# EAGLE design sensor_elec_sd (EAGLE 6.5.0)
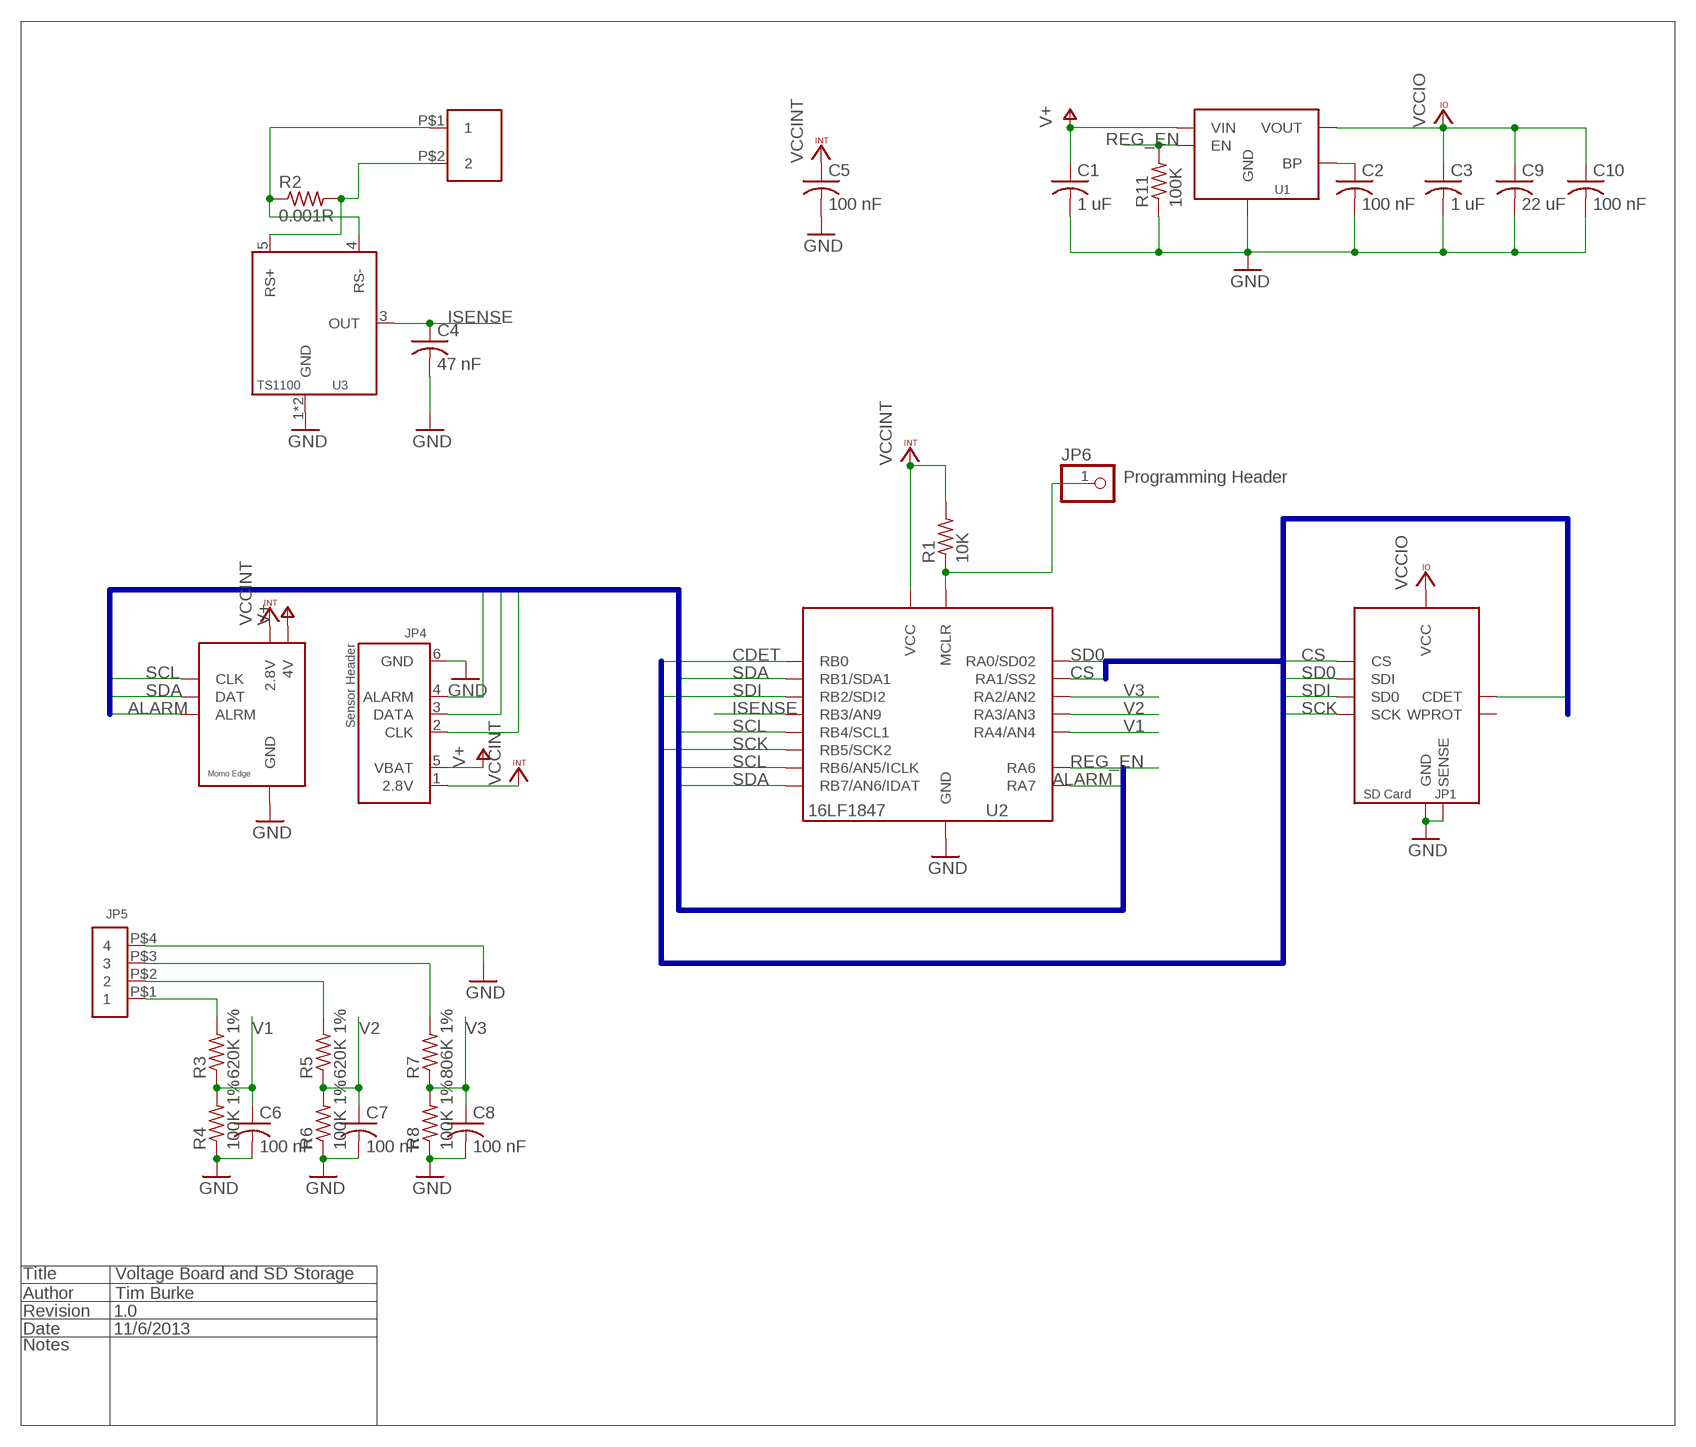
[diagram p0: schematic, sheet 1]

## Parts
C1  1 uF  C-USC0402K  [C0402K]
C2  100 nF  C-USC0402K  [C0402K]
C3  1 uF  C-USC0402K  [C0402K]
C4  47 nF  C-USC0402K  [C0402K]
C5  100 nF  C-USC0402K  [C0402K]
C6  100 nF  C-USC0402K  [C0402K]
C7  100 nF  C-USC0402K  [C0402K]
C8  100 nF  C-USC0402K  [C0402K]
C9  22 uF  C-USC1206K  [C1206K]
C10  100 nF  C-USC0402K  [C0402K]
JP1  SDCARD-HOLDER  [SDHOLDER-9PIN]
JP2  MOMO-VERT-6M  [1X06]
JP3  5MM-SCREWTERM-2POS  [5MM-SCREWTERM]
JP4  MOMO-SENSOR-RJ11  [RJ-12]
JP5  SCREWTERM4  [SCREWTERM4]
JP6  PINHD-1X1  [1X01]
R1  10K  R-US_R0603  [R0603]
R2  0.001R  R-US_R2512  [R2512]
R3  620K 1%  R-US_R0603  [R0603]
R4  100K 1%  R-US_R0603  [R0603]
R5  620K 1%  R-US_R0603  [R0603]
R6  100K 1%  R-US_R0603  [R0603]
R7  806K 1%  R-US_R0603  [R0603]
R8  100K 1%  R-US_R0603  [R0603]
R11  100K  R-US_R0603  [R0603]
U1  AP7115-LDO  [SOT353]
U2  16LF1847  [SSOP20]
U3  TS1100  [SOT23-5L]

## Nets
ALARM: JP2.5(ALRM) JP4.4(ALARM) U2.18(RA7)
CDET: JP1.CDETECT(CDET) U2.7(RB0)
CS: JP1.1(CS) U2.20(RA1/SS2)
GND: C1.2 C2.2 C3.2 C4.2 C5.2 C6.2 C7.2 C8.2 C9.2 C10.2 JP1.3(GND) JP1.6(GND) JP1.CDGND(SENSE) JP1.CDGND_BOT(SENSE) JP1.WPGND(SENSE) JP1.WPGND_BOT(SENSE) JP2.7(GND) JP4.6(GND) JP5.P$4 R4.1 R6.1 R8.1 R11.1 U1.2(GND) U2.5(GND) U2.6(GND) U3.1(GND) U3.2(GND)
ISENSE: C4.1 U2.10(RB3/AN9) U3.3(OUT)
N$3: C2.1 U1.4(BP)
N$4: JP6.1 R1.1 U2.4(MCLR)
N$10: JP5.P$1 R3.2
N$11: JP5.P$2 R5.2
N$12: JP5.P$3 R7.2
REG_EN: R11.2 U1.3(EN) U2.17(RA6)
RS+: JP3.P$2 R2.2 U3.5(RS+)
RS-: JP3.P$1 R2.1 U3.4(RS-)
SCK: JP1.5(SCK) U2.12(RB5/SCK2)
SCL: JP2.3(CLK) JP4.2(CLK) U2.11(RB4/SCL1) U2.13(RB6/AN5/ICLK)
SD0: JP1.2(SDI) U2.19(RA0/SD02)
SDA: JP2.4(DAT) JP4.3(DATA) U2.8(RB1/SDA1) U2.14(RB7/AN6/IDAT)
SDI: JP1.7(SD0) U2.9(RB2/SDI2)
V1: C6.1 R3.1 R4.2 U2.3(RA4/AN4)
V2: C7.1 R5.1 R6.2 U2.2(RA3/AN3)
V3: C8.1 R7.1 R8.2 U2.1(RA2/AN2)
V+: C1.1 JP2.6(4V) JP4.5(VBAT) U1.1(VIN)
VCCINT: C5.1 JP2.1(2.8V) JP4.1(2.8V) R1.2 U2.15(VCC) U2.16(VCC)
VCCIO: C3.1 C9.1 C10.1 JP1.4(VCC) U1.5(VOUT)
Unconnected: JP1.WPROTECT(WPROT)

## Buses
SDBUS:SDI,SD0,SCK,CS,CDET
MIB:SDA,SCL,ALARM

## Notes on the sheet
- Programming Header
- Title | Voltage Board and SD Storage
- Author | Tim Burke
- Revision | 1.0
- Date | 11/6/2013
- Notes

## Library data of the parts
C1 C3 = rcl:C-US: CAPACITOR, American symbol; DIGIKEY-PN: 445-4114-1-ND
C2 C5-C8 C10 = rcl:C-US: CAPACITOR, American symbol; DIGIKEY-PN: 445-1265-1-ND
C4 = rcl:C-US: CAPACITOR, American symbol; DIGIKEY-PN: 399-3020-1-ND
C9 = rcl:C-US: CAPACITOR, American symbol; DIGIKEY-PN: 478-3865-1-ND
JP1 = components:SDCARD-HOLDER; DIGIKEY-PN: 732-3817-1-ND
JP2 = components:MOMO-VERT-6M; DIGIKEY-PN: S7004-ND
JP3 = components:5MM-SCREWTERM-2POS; DIGIKEY-PN: 277-1667-ND
JP4 = components:MOMO-SENSOR-RJ11; DIGIKEY-PN: AE10383-ND
JP5 = components:SCREWTERM4; DIGIKEY-PN: A98335-ND
JP6 = pinhead:PINHD-1X1: PIN HEADER
R1 = rcl:R-US_: RESISTOR, American symbol; DIGIKEY-PN: P10.0KHCT-ND
R2 = rcl:R-US_: RESISTOR, American symbol; DIGIKEY-PN: CRF2512-FV-R001ELFCT-ND
R3 R5 = rcl:R-US_: RESISTOR, American symbol; DIGIKEY-PN: P620KHCT-ND
R4 R6 R8 R11 = rcl:R-US_: RESISTOR, American symbol; DIGIKEY-PN: P100KHCT-ND
R7 = rcl:R-US_: RESISTOR, American symbol; DIGIKEY-PN: P806KHCT-ND
U1 = components:AP7115-LDO; DIGIKEY-PN: AP7115-28SEGDICT-ND
U2 = components:16LF1847; DIGIKEY-PN: PIC16LF1847-I/SS-ND
U3 = components:TS1100; DIGIKEY-PN: TS1100-100EG5TCT-ND

## Board
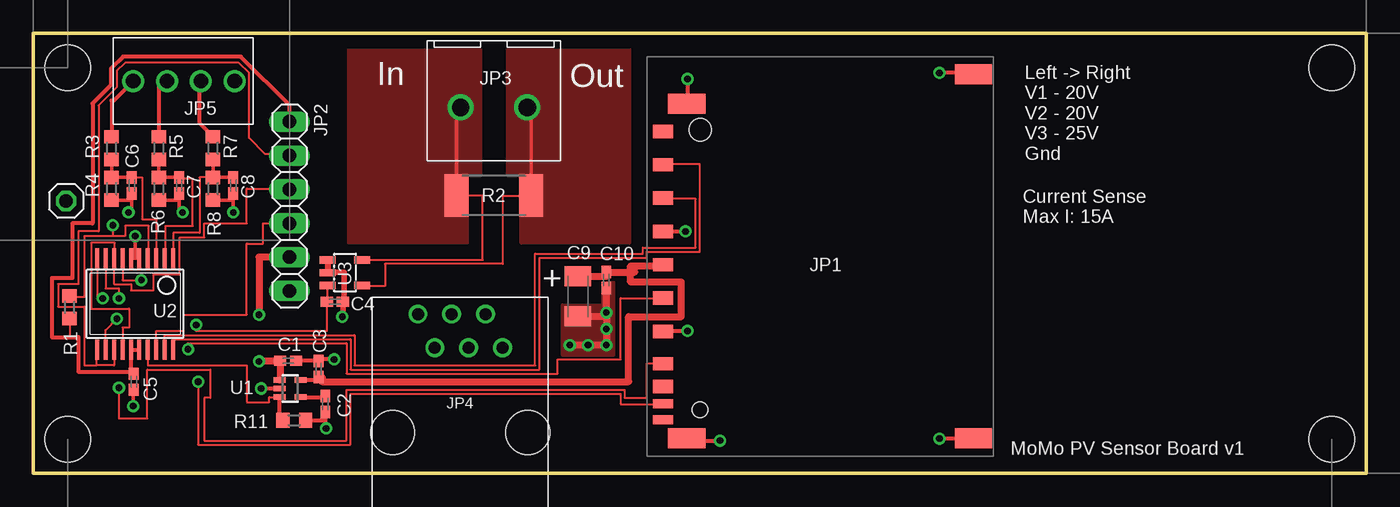
[diagram p1: board, top side]
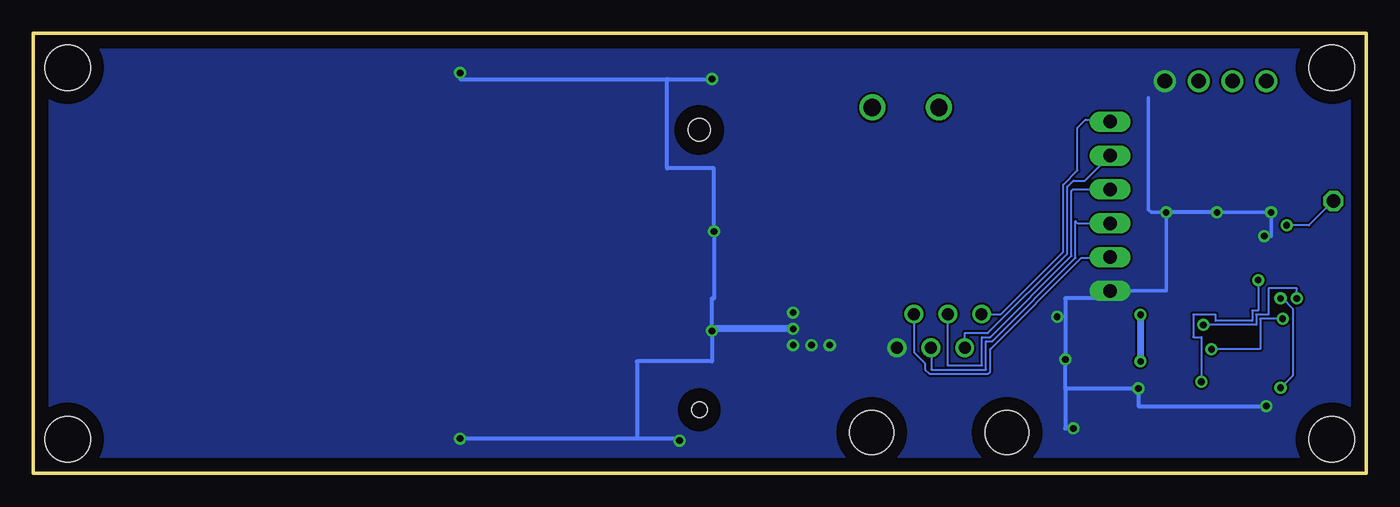
[diagram p2: board, bottom side, seen from below]

Size 100.03 x 33.02 mm. Coordinates in mm from the lower left corner, seen from the top.
Outline: 0,33.02 0,0 100.03,0 100.03,33.02 0,33.02
Copper layers (1*16): Top 0.035mm / dielectric 1.5mm / Bottom 0.035mm
Design rules "default *": minimum track width 6mil, minimum drill 19mil, track to track 6mil, track to pad 6mil, pad to pad 8mil, via to via 8mil, smd to smd 8mil, copper to edge 40mil, drill to drill 8mil, minimum pad ring 10mil, minimum via ring 8mil, stop-mask expansion 4mil, vias tented up to drill 0mil, thermal gap 10mil
Holes 3.43 mm at 2.57,2.57 2.57,30.45 97.46,30.45 97.46,2.57

### Footprints (pad centres in the part's own frame; a part is rotated, then mirrored left to right if it is on the bottom)
C0402K = smd 0.925 x 0.74: 1 -0.6,0; 2 0.6,0
C1206K = smd 1.5 x 2: 1 -1.5,0; 2 1.5,0
SDHOLDER-9PIN = smd 1 x 1.5: 1 6.875,1.8; 2 4.375,1.8; 3 1.875,1.8; 4 -0.625,1.8; 5 -3.125,1.8; 6 -5.625,1.8; 7 -8.05,1.8; 8 -9.75,1.8; 9 9.375,1.8 | smd 0.7 x 1.5: CDETECT -11.05,1.8; WPROTECT -12.25,1.8 | smd 1.5 x 2.8: CDGND 11.45,0; CDGND_BOT 13.65,-21.5; WPGND -13.65,0; WPGND_BOT -13.65,-21.5 | hole 1.18: -11.5,-1 | hole 1.68: 9.5,-1
1X06 = drill 1.016 long: 1 -8.89,0; 3 -6.35,0; 4 -3.81,0; 5 -1.27,0; 6 1.27,0; 7 3.81,0
5MM-SCREWTERM = drill 1.3: P$1 -3,0; P$2 2,0
RJ-12 = drill 0.9: 1 -3.17,8.89; 2 -1.9,6.35; 3 -0.63,8.89; 4 0.64,6.35; 5 1.91,8.89; 6 3.18,6.35 | hole 3.28: -5.08,0; 5.08,0
SCREWTERM4 = drill 1.1: P$1 0,0; P$2 2.54,0; P$3 5.08,0; P$4 7.62,0
1X01 = drill 1.016 octagon: 1 0,0
R0603 = smd 1 x 1.1: 1 -0.85,0; 2 0.85,0
R2512 = smd 1.8 x 3.2: 1 -2.8,0; 2 2.8,0
SOT353 = smd 0.4 x 0.9: 1 -0.65,-0.8; 2 0,-0.8; 3 0.65,-0.8; 4 0.65,0.8; 5 -0.65,0.8
SSOP20 = smd 0.3 x 1.5: 1 -2.857,-3.431; 2 -2.222,-3.431; 3 -1.587,-3.431; 4 -0.952,-3.431; 5 -0.317,-3.431; 6 0.318,-3.431; 7 0.953,-3.431; 8 1.588,-3.431; 9 2.223,-3.431; 10 2.858,-3.431; 11 2.858,3.431; 12 2.219,3.431; 13 1.588,3.431; 14 0.953,3.431; 15 0.318,3.431; 16 -0.317,3.431; 17 -0.952,3.431; 18 -1.587,3.431; 19 -2.222,3.431; 20 -2.857,3.431
SOT23-5L = smd 0.55 x 1.2: 1 -0.95,-1.3; 2 0,-1.3; 3 0.95,-1.3; 4 0.95,1.3; 5 -0.95,1.3

### Placement (x,y rotation side)
C1  19.13,8.46 0 top
C2  21.92,5.21 270 top
C3  21.41,7.85 90 top
C4  22.63,12.88 0 top
C5  7.54,6.88 270 top
C6  7.39,21.62 270 top
C7  10.95,21.62 270 top
C8  15.01,21.62 270 top
C9  40.87,13.28 270 top
C10  43,14.5 270 top
JP1  49.05,16.28 90 top
JP2  19.23,17.5 270 top
JP3  34.06,27.46 180 top
JP4  32.03,3.07 0 top
JP5  7.49,29.44 0 top
JP6  2.46,20.45 0 top
R1  2.72,12.47 270 top
R2  34.57,20.85 180 top
R3  5.87,24.41 90 top
R4  5.87,21.36 90 top
R5  9.42,24.41 90 top
R6  9.42,21.36 90 top
R7  13.49,24.41 90 top
R8  13.49,21.36 90 top
R11  19.58,3.99 180 top
U1  19.28,6.38 270 top
U2  7.65,12.73 180 top
U3  23.39,15.06 270 top

### Tracks (layer width: path | path; a pad name or v marks a point on that pad's centre or on a via)
ALARM
  Top 0.152: U2.18 9.23,10.69 11.3,10.69 11.3,11.91 16.03,11.91 16.03,17.25 17.25,17.25 17.25,18.77 JP2.5
  Bottom 0.152: JP4.4 32.64,9.42 32.64,7.8 28.52,7.8 28.52,9.93 28.07,9.93 21.82,16.18 21.82,18.92 21.67,18.77 JP2.5
CDET  (via drill 0.5)
  Top 0.152: U2.7 6.69,14.5 v8.1,14.5 | v12.37,6.88 12.37,2.16 23.8,2.16 23.8,5.97 44.07,5.97 44.07,5.21 47.25,5.21 JP1.CDETECT
  Bottom 0.152: v8.1,14.5 8.1,12.22 8.56,12.22 8.56,11.46 11.3,11.46 11.3,11.91 12.98,11.91 12.98,10.24 12.37,10.24 v12.37,6.88
CS
  Top 0.152: U2.20 10.5,10.08 23.8,10.08 23.8,7.8 37.97,7.8 37.97,16.18 46.05,16.18 46.05,16.64 50.01,16.64 50.01,23.19 47.25,23.19 JP1.1
GND  (via drill 0.5)
  Top 0.152: 7.49,6.28 C5.2 | 22.09,15.92 U3.1 U3.2
  Top 0.254: R8.1 15.01,20.51 | 15.01,20.51 C8.2 | R6.1 10.95,20.51 | 10.95,20.51 C7.2 | R4.1 7.39,20.51 | 7.39,20.51 C6.2 | U2.5 U2.6 7.65,16.16 v7.65,17.81 | v7.14,19.58 7.39,19.58 7.39,20.51 | v11.2,19.58 10.95,19.58 10.95,20.51 | v15.01,19.58 15.01,20.51 | 7.49,6.28 v7.49,5.05
  Top 0.305: U1.2 v17.09,6.38 17.09,6.27 | v22.58,8.56 21.41,8.56 C3.2 C1.2 | v21.97,3.38 21.92,3.38 C2.2 21.92,3.99 R11.1 | JP1.6 47.25,10.69 v49.1,10.69 | JP1.3 v48.95,18.16 | JP1.WPGND 49.05,2.46 v51.54,2.46 | v68,2.62 68,2.63 JP1.WPGND_BOT | JP1.CDGND_BOT 70.55,30.05 v68,30.05 | v49.1,29.59 49.1,27.73 JP1.CDGND
  Top 0.406: U3.2 22.09,16 22.12,16.03 22.12,15.11 23.34,15.11 23.34,12.88 C4.2 23.23,11.76 v23.19,11.76
  Top 0.508: C9.2 43,11.78 | 43,11.78 v43,12.07 C10.2 | 43,11.78 v43,10.85 v43,9.63 v41.63,9.63 v40.26,9.63
  Bottom 0.152: 19.23,13.13 JP2.7
  Bottom 0.254: v7.65,17.81 7.14,17.81 v7.14,19.58 v11.2,19.58 | JP2.7 15.01,13.69 v15.01,19.58 16.13,19.58 16.33,19.79 16.33,28.17
  Bottom 0.305: 19.23,13.13 22.58,13.13 v22.58,8.56 22.58,6.38 | 22.58,6.38 v17.09,6.38 17.09,5.05 v7.49,5.05 | v11.2,19.58 v15.01,19.58 | v51.54,2.46 51.54,2.62 54.74,2.62 | 54.74,2.62 v68,2.62 | v68,30.05 68,29.59 v49.1,29.59 52.45,29.59 52.45,22.89 48.95,22.89 v48.95,18.16 48.95,13.13 49.1,13.13 v49.1,10.69 49.1,8.41 54.74,8.41 54.74,2.62 | 22.58,6.38 22.58,3.38 v21.97,3.38
  Bottom 0.508: v43,10.85 49.1,10.85 v49.1,10.69
  pour Top (no thermals): 42.7,14.2 42.7,12.67 39.65,12.67 39.65,8.86 43.61,8.86 43.61,14.35 42.7,14.35
  pour Bottom (no thermals): -0.58,33.55 -0.58,-0.74 101.22,-0.74 101.22,33.55
ISENSE  (via drill 0.5)
  Top 0.152: U2.10 4.79,13.13 v5.21,13.13 | v12.22,11.15 12.22,10.69 22.03,10.69 C4.1 22.09,12.88 U3.3
  Bottom 0.152: v5.21,13.13 5.21,13.89 7.34,13.89 7.34,11.91 8.26,11.91 8.26,11.15 v12.22,11.15
N$3
  Top 0.305: U1.4 21.92,5.73 C2.1
N$4  (via drill 0.5)
  Top 0.152: U2.4 8.66,16.16 8.66,18.57 6.88,18.57 6.88,17.81 5.97,17.81 | R1.1 2.57,13.23 3.84,13.23 3.84,17.81 5.66,17.81 5.97,17.81 | v5.97,18.62 5.97,17.81
  Bottom 0.152: JP6.1 4.29,18.62 v5.97,18.62
N$10
  Top 0.305: JP5.P$1 6.02,27.97 5.87,27.97 R3.2
N$11
  Top 0.305: JP5.P$2 9.88,29.44 9.42,28.98 R5.2
N$12
  Top 0.305: JP5.P$3 12.47,29.34 12.47,26.28 R7.2
REG_EN
  Top 0.152: U2.17 8.6,8.1 16.03,8.1 16.03,5.36 17.7,5.36 17.7,5.73 U1.3
  Top 0.305: R11.2 18.48,3.99 U1.3
RS+
  Top 0.152: R2.2 33.72,20.85 33.72,16.03 24.69,16.03 U3.5
  Top 0.254: JP3.P$2 31.77,27.46 R2.2
  pour Top (no thermals): 33.55,32.54 23.65,32.54 23.65,17.3 32.54,17.3 32.54,22.38 33.55,22.38
RS-
  Top 0.152: R2.1 35.23,20.85 35.23,15.72 26.39,15.72 26.39,14.05 24.69,14.05 U3.4
  Top 0.254: JP3.P$1 37.37,27.46 R2.1
  pour Top (no thermals): 35.59,22.38 35.59,32.54 44.73,32.54 44.73,17.3 36.6,17.3 36.6,22.38
SCK  (via drill 0.5)
  Top 0.152: U2.12 5.43,10.76 v6.27,11.61 | v11.61,9.32 11.61,9.78 23.5,9.78 23.5,7.49 39.34,7.49 39.34,8.56 44.07,8.56 44.07,13.16 JP1.5
  Bottom 0.152: v6.27,11.61 7.95,11.61 7.95,9.32 v11.61,9.32
SCL
  Top 0.152: 4.85,9.29 U2.11 4.75,9.29 4.75,8.1 | JP2.3 19.13,23.95 17.4,23.95 16.18,25.17 16.18,30.05 15.42,30.81 6.88,30.81 6.27,30.2 6.27,28.98 4.9,27.61 4.9,18.16 3.38,18.16 3.38,14.2 1.85,14.2 1.85,12.52 3.84,12.52 3.84,8.1 4.75,8.1 | U2.13 6.06,8.1 4.75,8.1
  Bottom 0.152: JP4.2 30.13,10.54 28.37,10.54 22.43,16.48 22.43,21.51 21.97,21.97 21.11,21.97 JP2.3
SD0
  Top 0.152: U2.19 9.87,10.39 24.1,10.39 24.1,8.1 37.67,8.1 37.67,16.48 45.75,16.48 45.75,16.94 49.71,16.94 49.71,20.6 47.25,20.6 JP1.2
SDA
  Top 0.152: U2.14 6.69,10.95 7.19,10.95 7.19,12.37 4.34,12.37 4.34,17.3 6.12,17.3 6.12,16.16 U2.8 6.06,14.2 7.34,14.2 7.34,13.74 9.02,13.74 9.02,14.96 11,14.96 11,17.7 12.83,17.7 12.83,18.77 16.03,18.77 16.03,21.36 19.23,21.36 JP2.4
  Bottom 0.152: JP4.3 31.42,11.96 31.42,8.1 28.83,8.1 28.83,10.24 28.22,10.24 22.12,16.33 22.12,21.21 22.02,21.31 JP2.4
SDI  (via drill 0.5)
  Top 0.152: U2.9 5.42,13.89 6.43,13.89 v6.43,13.13 | v6.43,6.43 6.43,4.14 8.56,4.14 8.56,7.8 13.28,7.8 13.28,5.66 12.83,5.66 12.83,2.46 23.5,2.46 23.5,6.27 44.37,6.27 44.37,5.66 46.05,5.66 46.05,8.26 47.25,8.26 JP1.7
  Bottom 0.152: v6.43,13.13 6.27,13.13 5.51,12.37 5.51,7.34 v6.43,6.43
V1
  Top 0.152: C6.1 8.15,22.22 8.15,19.08 9.23,19.08 U2.3
  Top 0.254: R3.1 R4.2 C6.1
V2
  Top 0.152: U2.2 9.93,16.16 9.93,18.57 11.96,18.57 11.96,22.12 10.95,22.12 C7.1
  Top 0.254: R5.1 R6.2 C7.1
V3
  Top 0.152: R8.2 12.47,22.21 12.47,18.06 10.5,18.06 U2.1
  Top 0.254: R7.1 R8.2 C8.1
V+  (via drill 0.5)
  Top 0.508: JP2.6 16.94,16.23 v16.94,11.91 | v16.94,8.41 16.94,8.46 C1.1 18.53,7.03 U1.1
  Bottom 0.152: JP4.5 33.94,9.1 33.1,8.26 33.1,7.8 32.79,7.49 28.37,7.49 28.22,7.65 28.22,9.32 21.36,16.18 19.28,16.18 JP2.6
  Bottom 0.508: v16.94,11.91 v16.94,8.41
VCCINT
  Top 0.152: R1.2 2.72,10.24 2.77,10.24
  Top 0.305: JP2.1 19.23,27.61 15.57,31.27 6.73,31.27 5.82,30.35 5.82,29.13 4.45,27.76 4.45,18.77 2.92,18.77 2.92,14.66 1.4,14.66 1.4,10.24 2.77,10.24 3.38,10.24 3.38,7.65 7.33,7.65 | C5.1 7.39,7.65 7.33,7.65 | 7.33,7.65 U2.15 U2.16
  Bottom 0.152: JP4.1 27.41,11.96 22.73,16.64 22.73,21.67 21.67,22.73 21.67,25.93 21.06,26.54 19.38,26.54 JP2.1
VCCIO
  Top 0.152: C3.1 21.67,7.25 21.67,7.19
  Top 0.305: U1.5 21.41,7.03 C3.1
  Top 0.508: 45.14,15.57 44.83,15.57 44.83,14.35 48.64,14.35 48.64,11.76 44.68,11.76 44.68,6.88 21.67,6.88 21.67,7.25 | 45.14,15.57 47.25,15.57 JP1.4 | C9.1 43,14.78 C10.1 45.14,15.1 45.14,15.57

### Text on the board
tPlace: In | Out | Left -> Right / V1 - 20V / V2 - 20V / V3 - 25V / Gnd | Current Sense / Max I: 15A | + | MoMo PV Sensor Board v1